# EAGLE design left (EAGLE 9.1.3)
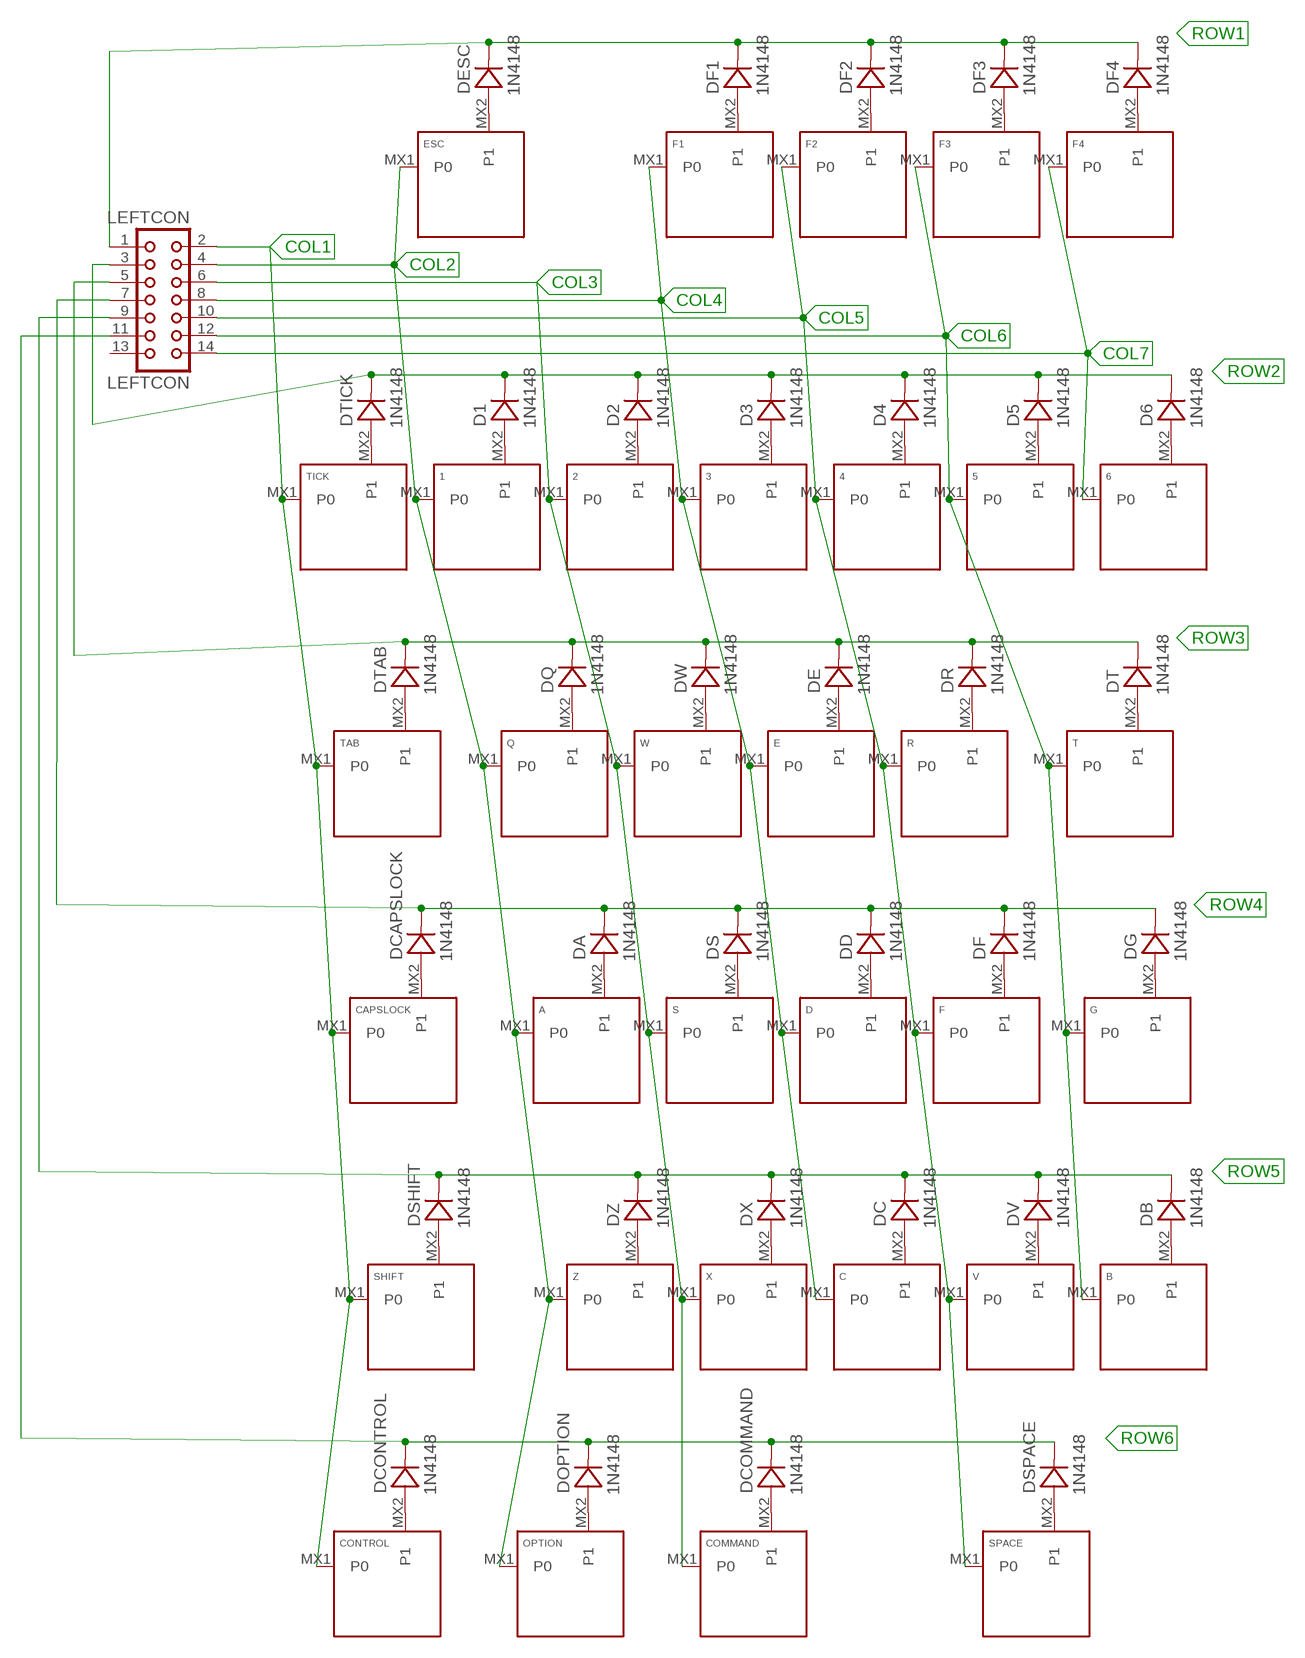
[diagram p0: schematic, sheet 1]

## Parts
1  KEYSWITCH-PLAIN-MX-1U  [MX-1U]
2  KEYSWITCH-PLAIN-MX-1U  [MX-1U]
3  KEYSWITCH-PLAIN-MX-1U  [MX-1U]
4  KEYSWITCH-PLAIN-MX-1U  [MX-1U]
5  KEYSWITCH-PLAIN-MX-1U  [MX-1U]
6  KEYSWITCH-PLAIN-MX-1U  [MX-1U]
A  KEYSWITCH-PLAIN-MX-1U  [MX-1U]
B  KEYSWITCH-PLAIN-MX-1U  [MX-1U]
C  KEYSWITCH-PLAIN-MX-1U  [MX-1U]
CAPSLOCK  KEYSWITCH-PLAIN-MX-1U  [MX-1U]
COMMAND  KEYSWITCH-PLAIN-MX-1U  [MX-1U]
CONTROL  KEYSWITCH-PLAIN-MX-1U  [MX-1U]
D  KEYSWITCH-PLAIN-MX-1U  [MX-1U]
D1  1N4148  DIODE-DO-35  [DO-35]
D2  1N4148  DIODE-DO-35  [DO-35]
D3  1N4148  DIODE-DO-35  [DO-35]
D4  1N4148  DIODE-DO-35  [DO-35]
D5  1N4148  DIODE-DO-35  [DO-35]
D6  1N4148  DIODE-DO-35  [DO-35]
DA  1N4148  DIODE-DO-35  [DO-35]
DB  1N4148  DIODE-DO-35  [DO-35]
DC  1N4148  DIODE-DO-35  [DO-35]
DCAPSLOCK  1N4148  DIODE-DO-35  [DO-35]
DCOMMAND  1N4148  DIODE-DO-35  [DO-35]
DCONTROL  1N4148  DIODE-DO-35  [DO-35]
DD  1N4148  DIODE-DO-35  [DO-35]
DE  1N4148  DIODE-DO-35  [DO-35]
DESC  1N4148  DIODE-DO-35  [DO-35]
DF  1N4148  DIODE-DO-35  [DO-35]
DF1  1N4148  DIODE-DO-35  [DO-35]
DF2  1N4148  DIODE-DO-35  [DO-35]
DF3  1N4148  DIODE-DO-35  [DO-35]
DF4  1N4148  DIODE-DO-35  [DO-35]
DG  1N4148  DIODE-DO-35  [DO-35]
DOPTION  1N4148  DIODE-DO-35  [DO-35]
DQ  1N4148  DIODE-DO-35  [DO-35]
DR  1N4148  DIODE-DO-35  [DO-35]
DS  1N4148  DIODE-DO-35  [DO-35]
DSHIFT  1N4148  DIODE-DO-35  [DO-35]
DSPACE  1N4148  DIODE-DO-35  [DO-35]
DT  1N4148  DIODE-DO-35  [DO-35]
DTAB  1N4148  DIODE-DO-35  [DO-35]
DTICK  1N4148  DIODE-DO-35  [DO-35]
DV  1N4148  DIODE-DO-35  [DO-35]
DW  1N4148  DIODE-DO-35  [DO-35]
DX  1N4148  DIODE-DO-35  [DO-35]
DZ  1N4148  DIODE-DO-35  [DO-35]
E  KEYSWITCH-PLAIN-MX-1U  [MX-1U]
ESC  KEYSWITCH-PLAIN-MX-1U  [MX-1U]
F  KEYSWITCH-PLAIN-MX-1U  [MX-1U]
F1  KEYSWITCH-PLAIN-MX-1U  [MX-1U]
F2  KEYSWITCH-PLAIN-MX-1U  [MX-1U]
F3  KEYSWITCH-PLAIN-MX-1U  [MX-1U]
F4  KEYSWITCH-PLAIN-MX-1U  [MX-1U]
G  KEYSWITCH-PLAIN-MX-1U  [MX-1U]
LEFTCON  LEFTCON  CON14  [CON14]
OPTION  KEYSWITCH-PLAIN-MX-1U  [MX-1U]
Q  KEYSWITCH-PLAIN-MX-1U  [MX-1U]
R  KEYSWITCH-PLAIN-MX-1U  [MX-1U]
S  KEYSWITCH-PLAIN-MX-1U  [MX-1U]
SHIFT  KEYSWITCH-PLAIN-MX-2U  [MX-2U]
SPACE  KEYSWITCH-PLAIN-MX-2U  [MX-2U]
T  KEYSWITCH-PLAIN-MX-1U  [MX-1U]
TAB  KEYSWITCH-PLAIN-MX-1U  [MX-1U]
TICK  KEYSWITCH-PLAIN-MX-1U  [MX-1U]
V  KEYSWITCH-PLAIN-MX-1U  [MX-1U]
W  KEYSWITCH-PLAIN-MX-1U  [MX-1U]
X  KEYSWITCH-PLAIN-MX-1U  [MX-1U]
Z  KEYSWITCH-PLAIN-MX-1U  [MX-1U]

## Nets
COL1: CAPSLOCK.MX1(P0) CONTROL.MX1(P0) LEFTCON.2 SHIFT.MX1(P0) TAB.MX1(P0) TICK.MX1(P0)
COL2: 1.MX1(P0) A.MX1(P0) ESC.MX1(P0) LEFTCON.4 OPTION.MX1(P0) Q.MX1(P0) Z.MX1(P0)
COL3: 2.MX1(P0) COMMAND.MX1(P0) LEFTCON.6 S.MX1(P0) W.MX1(P0) X.MX1(P0)
COL4: 3.MX1(P0) C.MX1(P0) D.MX1(P0) E.MX1(P0) F1.MX1(P0) LEFTCON.8
COL5: 4.MX1(P0) F2.MX1(P0) F.MX1(P0) LEFTCON.10 R.MX1(P0) SPACE.MX1(P0) V.MX1(P0)
COL6: 5.MX1(P0) B.MX1(P0) F3.MX1(P0) G.MX1(P0) LEFTCON.12 T.MX1(P0)
COL7: 6.MX1(P0) F4.MX1(P0) LEFTCON.14
N$1: DESC.A ESC.MX2(P1)
N$2: DF1.A F1.MX2(P1)
N$3: DF2.A F2.MX2(P1)
N$4: DF3.A F3.MX2(P1)
N$5: DF4.A F4.MX2(P1)
N$6: 6.MX2(P1) D6.A
N$7: 5.MX2(P1) D5.A
N$8: 4.MX2(P1) D4.A
N$9: 3.MX2(P1) D3.A
N$10: 2.MX2(P1) D2.A
N$11: 1.MX2(P1) D1.A
N$12: DTICK.A TICK.MX2(P1)
N$13: DTAB.A TAB.MX2(P1)
N$14: DQ.A Q.MX2(P1)
N$15: DW.A W.MX2(P1)
N$16: DE.A E.MX2(P1)
N$17: DR.A R.MX2(P1)
N$18: DT.A T.MX2(P1)
N$19: CAPSLOCK.MX2(P1) DCAPSLOCK.A
N$20: A.MX2(P1) DA.A
N$21: DS.A S.MX2(P1)
N$22: D.MX2(P1) DD.A
N$23: DF.A F.MX2(P1)
N$24: DG.A G.MX2(P1)
N$25: DSHIFT.A SHIFT.MX2(P1)
N$26: DZ.A Z.MX2(P1)
N$27: DX.A X.MX2(P1)
N$28: C.MX2(P1) DC.A
N$29: DV.A V.MX2(P1)
N$30: B.MX2(P1) DB.A
N$31: DSPACE.A SPACE.MX2(P1)
N$32: COMMAND.MX2(P1) DCOMMAND.A
N$33: DOPTION.A OPTION.MX2(P1)
N$34: CONTROL.MX2(P1) DCONTROL.A
ROW1: DESC.C DF1.C DF2.C DF3.C DF4.C LEFTCON.1
ROW2: D1.C D2.C D3.C D4.C D5.C D6.C DTICK.C LEFTCON.3
ROW3: DE.C DQ.C DR.C DT.C DTAB.C DW.C LEFTCON.5
ROW4: DA.C DCAPSLOCK.C DD.C DF.C DG.C DS.C LEFTCON.7
ROW5: DB.C DC.C DSHIFT.C DV.C DX.C DZ.C LEFTCON.9
ROW6: DCOMMAND.C DCONTROL.C DOPTION.C DSPACE.C LEFTCON.11
Unconnected: LEFTCON.13

## Library data of the parts
1-6 A B C CAPSLOCK COMMAND CONTROL D E ESC F F1-F4 G OPTION Q R S SHIFT SPACE T TAB TICK V W X Z = Keyboard:KEYSWITCH-PLAIN
D1-D6 DA DB DC DCAPSLOCK DCOMMAND DCONTROL DD DE DESC DF DF1-DF4 DG DOPTION DQ DR DS DSHIFT DSPACE DT DTAB DTICK DV DW DX DZ = Controller:DIODE: Standard 1N4148 diode
LEFTCON = con-harting:CON14: CONNECTOR; OC_FARNELL: unknown; OC_NEWARK: unknown

## Board
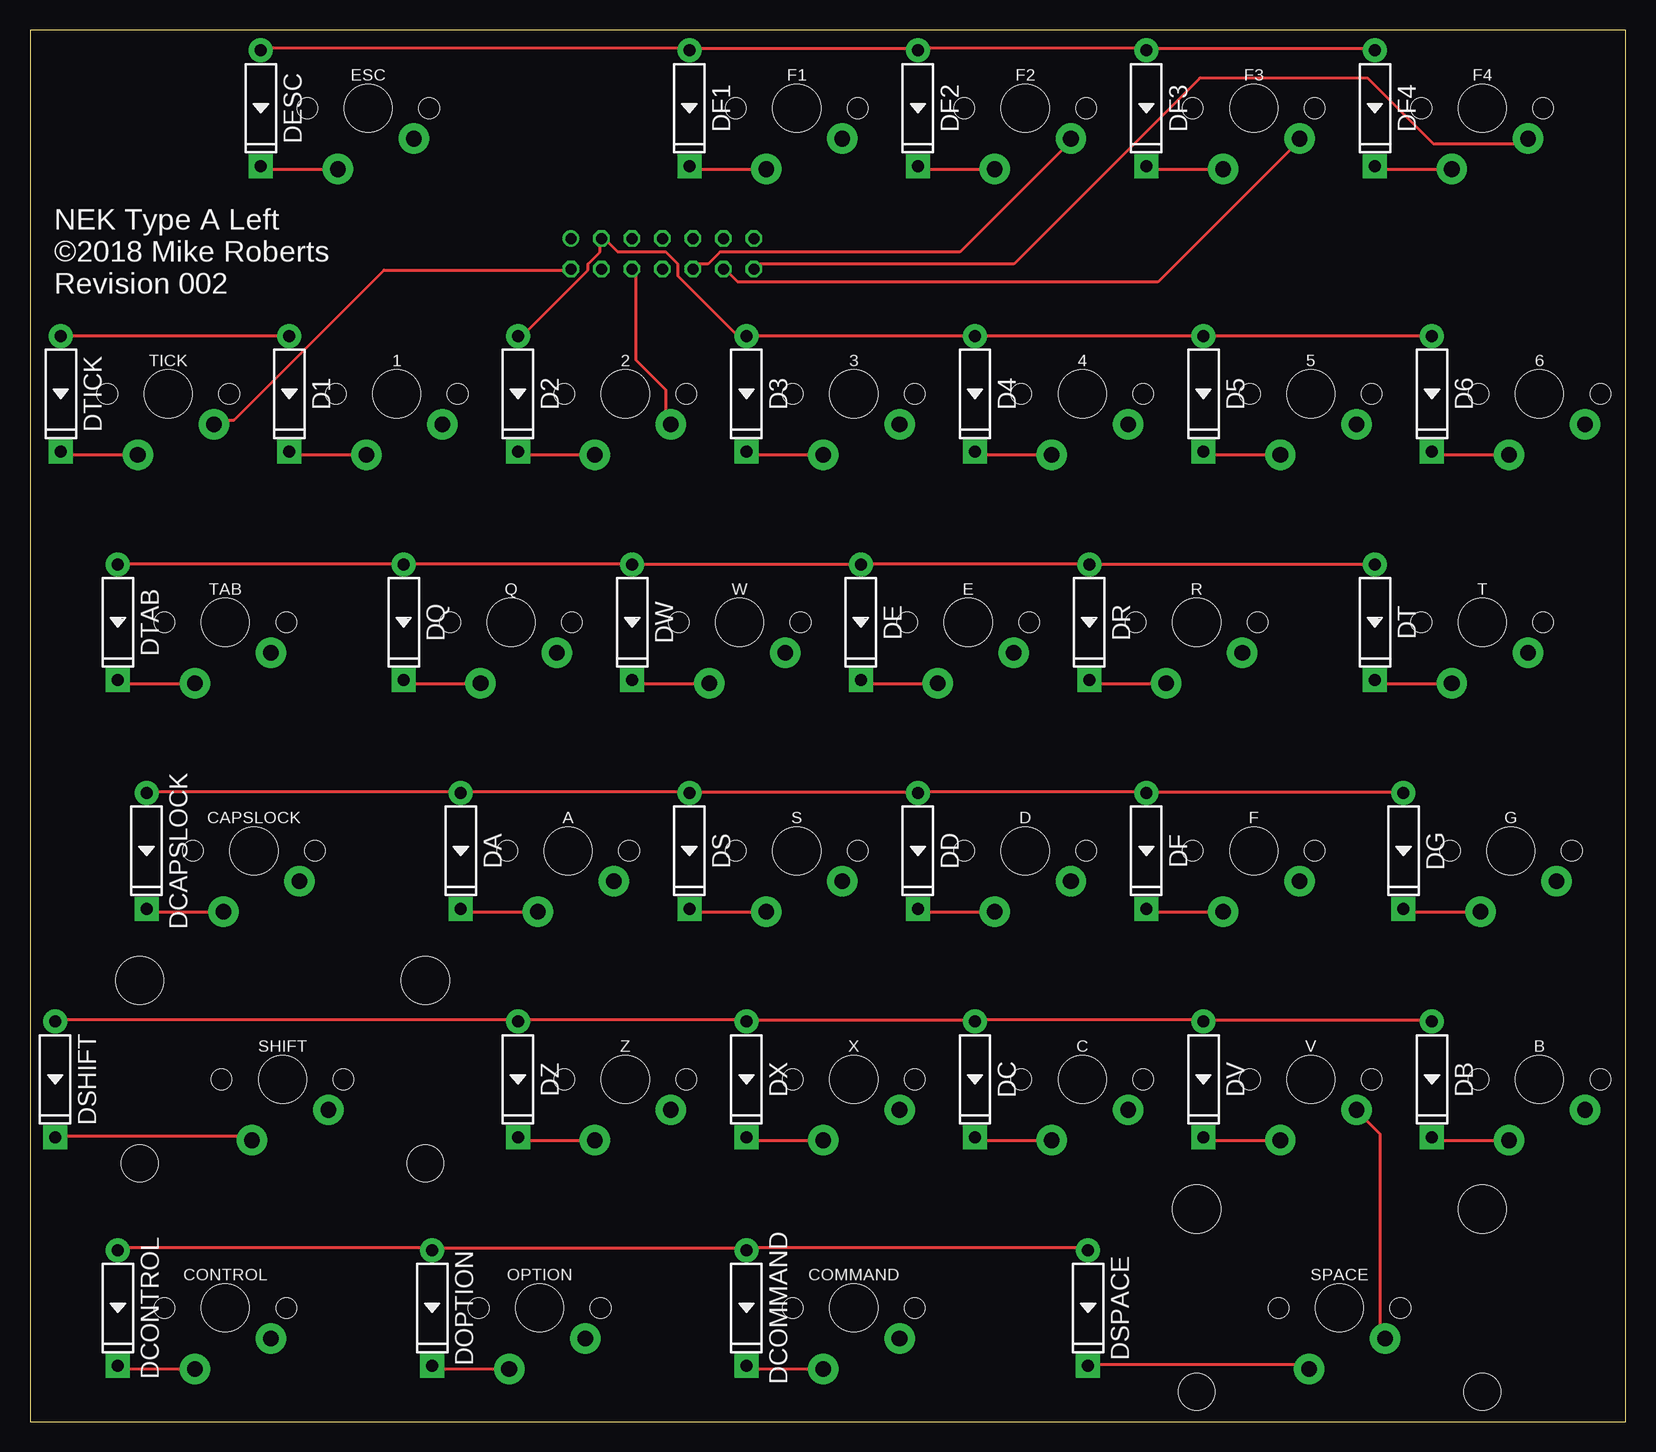
[diagram p1: board, top side]
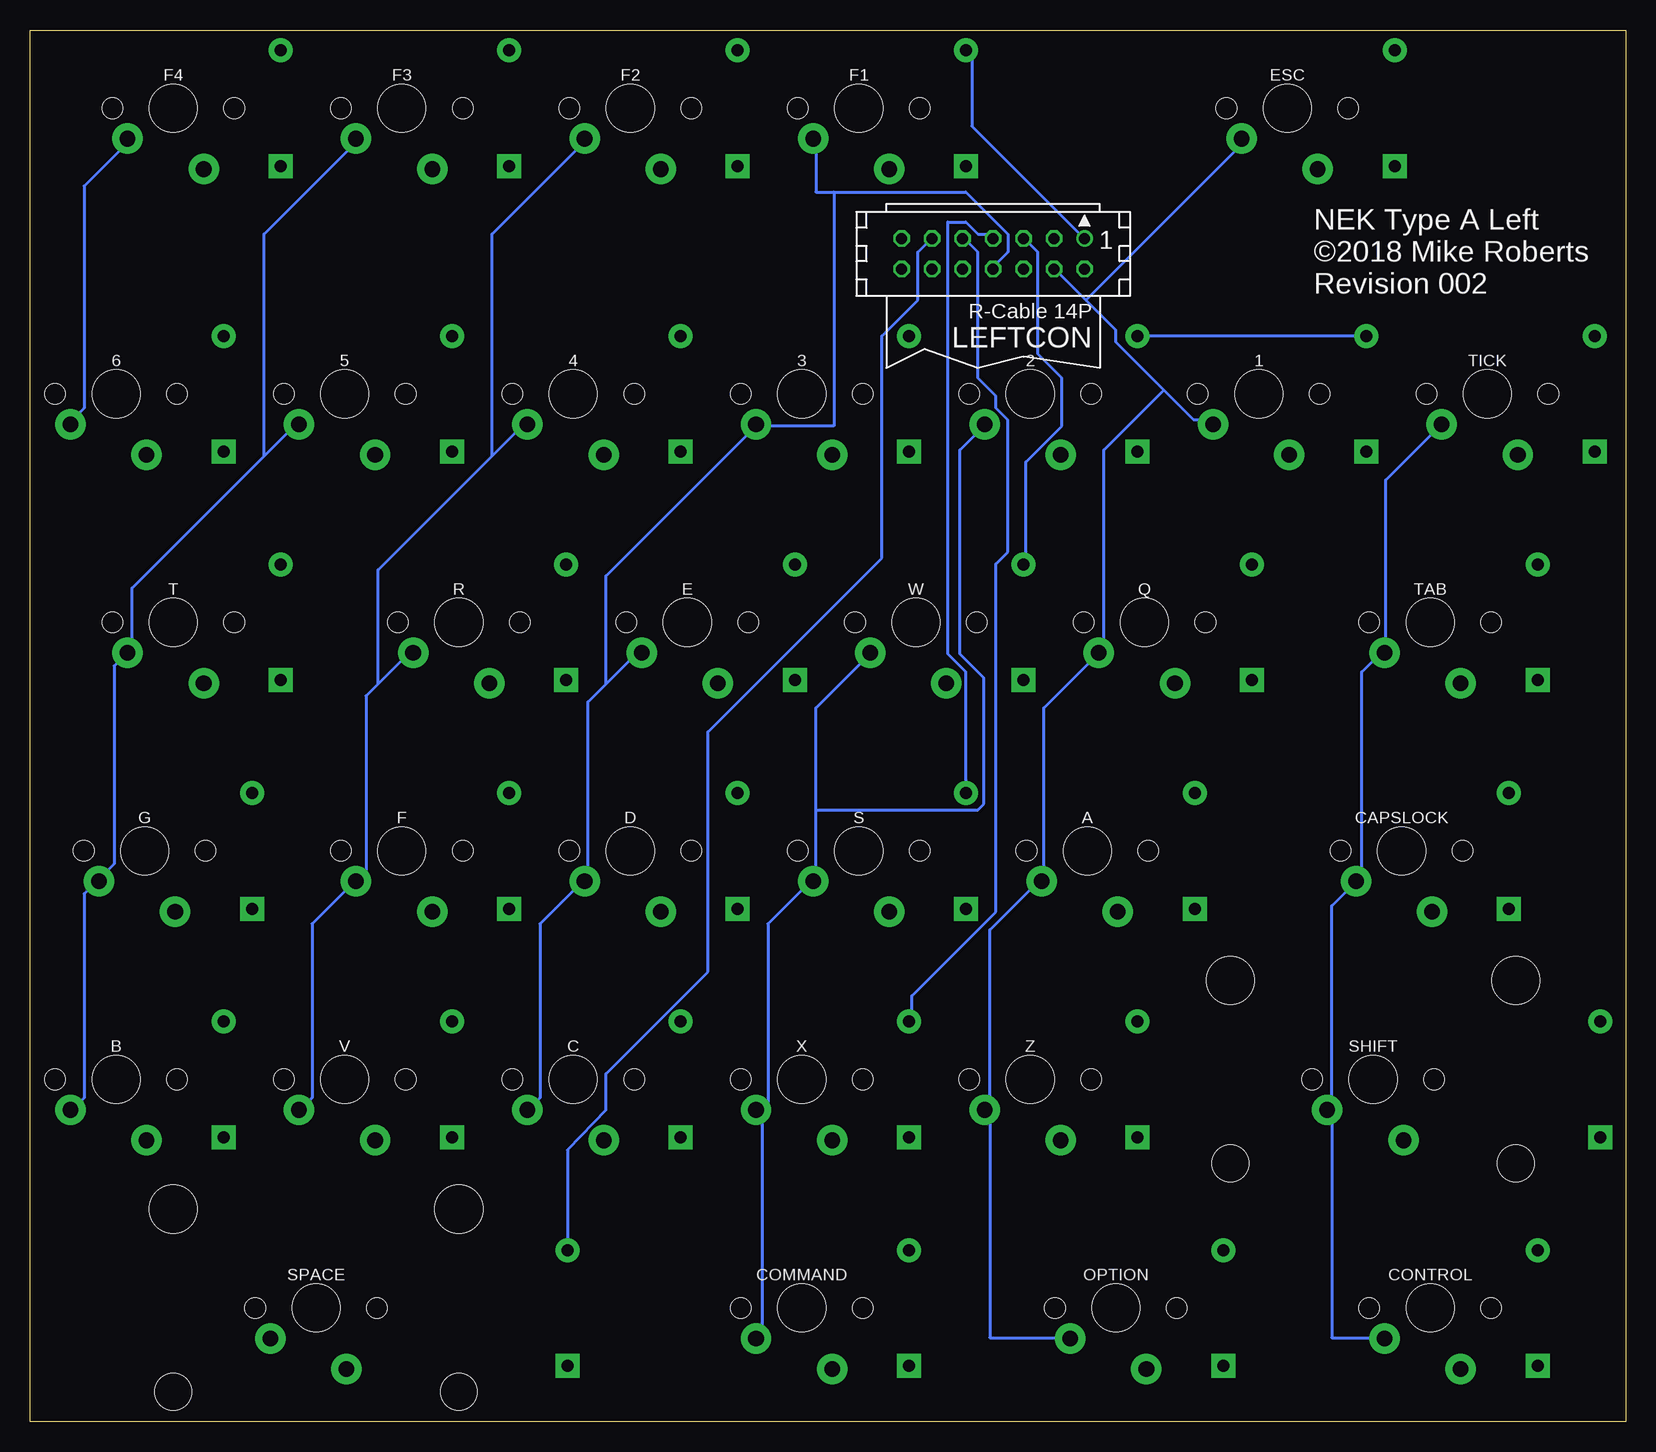
[diagram p2: board, bottom side, seen from below]

Size 133 x 116 mm. Coordinates in mm from the lower left corner, seen from the top.
Outline: 0,0 133,0 133,116 0,116 0,0
Copper layers (1*16): Top 0.035559375mm / dielectric 1.6mm / Bottom 0.035559375mm
Design rules "oshpark-2layer-auto-routing": minimum track width 10mil, minimum drill 10mil, track to track 10mil, track to pad 8mil, pad to pad 8mil, via to via 8mil, smd to smd 6mil, copper to edge 15mil, drill to drill 6mil, minimum pad ring 6mil, minimum via ring 6mil, stop-mask expansion 2.5mil, vias tented up to drill 0mil, thermal gap 10mil

### Footprints (pad centres in the part's own frame; a part is rotated, then mirrored left to right if it is on the bottom)
MX-1U = drill 1.3 pad 2.54: MX1 -3.81,2.54; MX2 2.54,5.08 | hole 4: 0,0 | hole 1.7: -5.08,0; 5.08,0
DO-35 = drill 1 pad 2 square: A 4.82,0 | drill 1 pad 2: C -4.82,0
CON14 = drill 0.914: 1 -7.62,-1.27 | drill 0.914 octagon: 2 -7.62,1.27; 3 -5.08,-1.27; 4 -5.08,1.27; 5 -2.54,-1.27; 6 -2.54,1.27; 7 0,-1.27; 8 0,1.27; 9 2.54,-1.27; 10 2.54,1.27; 11 5.08,-1.27; 12 5.08,1.27; 13 7.62,-1.27; 14 7.62,1.27
MX-2U = drill 1.3 pad 2.54: MX1 -3.81,2.54; MX2 2.54,5.08 | hole 4: 0,0; -11.9,-8.24; 11.9,-8.24 | hole 1.7: -5.08,0; 5.08,0 | hole 3.05: -11.9,7; 11.9,7

### Placement (x,y rotation side)
1  30.57,85.67 180 top
2  49.62,85.67 180 top
3  68.67,85.67 180 top
4  87.72,85.67 180 top
5  106.77,85.67 180 top
6  125.82,85.67 180 top
A  44.86,47.57 180 top
B  125.82,28.52 180 top
C  87.72,28.52 180 top
CAPSLOCK  18.66,47.57 180 top
COMMAND  68.67,9.47 180 top
CONTROL  16.28,9.47 180 top
D  82.96,47.57 180 top
D1  21.62,85.67 270 top
D2  40.67,85.67 270 top
D3  59.72,85.67 270 top
D4  78.77,85.67 270 top
D5  97.82,85.67 270 top
D6  116.87,85.67 270 top
DA  35.91,47.57 270 top
DB  116.87,28.52 270 top
DC  78.77,28.52 270 top
DCAPSLOCK  9.71,47.57 270 top
DCOMMAND  59.72,9.47 270 top
DCONTROL  7.33,9.47 270 top
DD  74.01,47.57 270 top
DE  69.25,66.62 270 top
DESC  19.24,109.48 270 top
DF  93.06,47.57 270 top
DF1  54.96,109.48 270 top
DF2  74.01,109.48 270 top
DF3  93.06,109.48 270 top
DF4  112.11,109.48 270 top
DG  114.49,47.57 270 top
DOPTION  33.53,9.47 270 top
DQ  31.15,66.62 270 top
DR  88.3,66.62 270 top
DS  54.96,47.57 270 top
DSHIFT  2.1,28.52 270 top
DSPACE  88.2,9.47 270 top
DT  112.11,66.62 270 top
DTAB  7.33,66.62 270 top
DTICK  2.57,85.67 270 top
DV  97.82,28.52 270 top
DW  50.2,66.62 270 top
DX  59.72,28.52 270 top
DZ  40.67,28.52 270 top
E  78.2,66.62 180 top
ESC  28.19,109.48 180 top
F  102.01,47.57 180 top
F1  63.91,109.48 180 top
F2  82.96,109.48 180 top
F3  102.01,109.48 180 top
F4  121.06,109.48 180 top
G  123.44,47.57 180 top
LEFTCON  52.72,97.35 180 bottom
OPTION  42.48,9.47 180 top
Q  40.1,66.62 180 top
R  97.25,66.62 180 top
S  63.91,47.57 180 top
SHIFT  21.05,28.52 180 top
SPACE  109.15,9.47 180 top
T  121.06,66.62 180 top
TAB  16.28,66.62 180 top
TICK  11.52,85.67 180 top
V  106.77,28.52 180 top
W  59.15,66.62 180 top
X  68.67,28.52 180 top
Z  49.62,28.52 180 top

### Tracks (layer width: path | path; a pad name or v marks a point on that pad's centre or on a via)
COL1
  Top 0.254: LEFTCON.2 45,96 29.5,96 17,83.5 15.5,83.5 TICK.MX1
  Bottom 0.254: CONTROL.MX1 20.5,7 24.5,7 24.5,25.5 SHIFT.MX1 24.5,26 24.5,43 22.5,45 CAPSLOCK.MX1 22,45.5 22,62.5 20.5,64 TAB.MX1 20,64.5 20,78.5 15.5,83 TICK.MX1
COL2
  Bottom 0.254: 45,93.5 42.5,91 42.5,90 38.5,86 | 45,93.5 47.5,96 LEFTCON.4 | 38.5,86 36,83.5 34.5,83.5 1.MX1 | 45,93.5 32,106.5 ESC.MX1 | OPTION.MX1 46.5,7 53,7 53,25.5 Z.MX1 53,26 53,41 49,45 A.MX1 48.5,45.5 48.5,59.5 44,64 Q.MX1 43.5,64.5 43.5,81 38.5,86
COL3
  Top 0.254: LEFTCON.6 50.5,96 50.5,88.5 53,86 53,83.5 2.MX1
  Bottom 0.254: COMMAND.MX1 72,7 72,25.5 X.MX1 72,26 71.5,26.5 71.5,41.5 68,45 S.MX1 67.5,45.5 67.5,51 | 67.5,51 67.5,59.5 63,64 W.MX1 | 67.5,51 54,51 53.5,51.5 53.5,62 55.5,64 55.5,81 53.5,83 2.MX1
COL4
  Bottom 0.254: 66,102.5 67.5,102.5 67.5,106.5 F1.MX1 | 66,102.5 55,102.5 51.5,99 51.5,97.5 52.5,96.5 LEFTCON.8 | 66,102.5 66,83 72,83 3.MX1 72.5,83 85,70.5 85,61.5 | C.MX1 91.5,26 90.5,27 90.5,41.5 87,45 D.MX1 86.5,45.5 86.5,60 85,61.5 | 85,61.5 82.5,64 E.MX1
COL5
  Top 0.254: LEFTCON.10 55.5,96.5 56.5,96.5 57.5,97.5 77.5,97.5 86.5,106.5 F2.MX1 | SPACE.MX1 112.5,7 112.5,24 111,25.5 V.MX1
  Bottom 0.254: 104,61.5 101.5,64 R.MX1 | 104,61.5 105,60.5 105,46 105.5,45.5 F.MX1 106,45 109.5,41.5 109.5,27 110.5,26 V.MX1 | 94.5,80.5 104,71 104,61.5 | 94.5,80.5 92,83 4.MX1 | 94.5,80.5 94.5,99 87,106.5 F2.MX1
COL6
  Top 0.254: LEFTCON.12 58,96 59,95 94,95 105.5,106.5 F3.MX1
  Bottom 0.254: B.MX1 129.5,26 128.5,27 128.5,44 127.5,45 G.MX1 127,45.5 126,46.5 126,63 125,64 T.MX1 124.5,64.5 124.5,69.5 113.5,80.5 | 113.5,80.5 111,83 5.MX1 | 113.5,80.5 113.5,99 106,106.5 F3.MX1
COL7
  Top 0.254: LEFTCON.14 60.5,96.5 82,96.5 97.5,112 111.5,112 117,106.5 124.5,106.5 F4.MX1
  Bottom 0.254: 6.MX1 129.5,83.5 128.5,84.5 128.5,103 125,106.5 F4.MX1
N$1
  Top 0.254: DESC.A 19.5,104.4 ESC.MX2
N$2
  Top 0.254: DF1.A 55.22,104.4 F1.MX2
N$3
  Top 0.254: DF2.A 74.27,104.4 F2.MX2
N$4
  Top 0.254: DF3.A 93.32,104.4 F3.MX2
N$5
  Top 0.254: DF4.A 112.37,104.4 F4.MX2
N$6
  Top 0.254: D6.A 117.13,80.59 6.MX2
N$7
  Top 0.254: D5.A 98.08,80.59 5.MX2
N$8
  Top 0.254: D4.A 79.03,80.59 4.MX2
N$9
  Top 0.254: D3.A 59.98,80.59 3.MX2
N$10
  Top 0.254: D2.A 40.93,80.59 2.MX2
N$11
  Top 0.254: D1.A 21.88,80.59 1.MX2
N$12
  Top 0.254: DTICK.A 2.83,80.59 TICK.MX2
N$13
  Top 0.254: DTAB.A 7.59,61.54 TAB.MX2
N$14
  Top 0.254: DQ.A 31.41,61.54 Q.MX2
N$15
  Top 0.254: DW.A 50.46,61.54 W.MX2
N$16
  Top 0.254: DE.A 69.51,61.54 E.MX2
N$17
  Top 0.254: DR.A 88.56,61.54 R.MX2
N$18
  Top 0.254: DT.A 112.37,61.54 T.MX2
N$19
  Top 0.254: DCAPSLOCK.A 9.97,42.49 CAPSLOCK.MX2
N$20
  Top 0.254: DA.A 36.17,42.49 A.MX2
N$21
  Top 0.254: DS.A 55.22,42.49 S.MX2
N$22
  Top 0.254: DD.A 74.27,42.49 D.MX2
N$23
  Top 0.254: DF.A 93.32,42.49 F.MX2
N$24
  Top 0.254: DG.A 114.75,42.49 G.MX2
N$25
  Top 0.254: DSHIFT.A 2.21,23.81 18.14,23.81 SHIFT.MX2
N$26
  Top 0.254: DZ.A 40.93,23.44 Z.MX2
N$27
  Top 0.254: DX.A 59.98,23.44 X.MX2
N$28
  Top 0.254: DC.A 79.03,23.44 C.MX2
N$29
  Top 0.254: DV.A 98.08,23.44 V.MX2
N$30
  Top 0.254: DB.A 117.13,23.44 B.MX2
N$31
  Top 0.254: DSPACE.A 88.31,4.76 106.24,4.76 SPACE.MX2
N$32
  Top 0.254: DCOMMAND.A 59.98,4.39 COMMAND.MX2
N$33
  Top 0.254: DOPTION.A 33.79,4.39 OPTION.MX2
N$34
  Top 0.254: DCONTROL.A 7.59,4.39 CONTROL.MX2
ROW1
  Top 0.254: DF4.C 112,114.5 93.5,114.5 DF3.C 93,114.5 74.5,114.5 DF2.C 74,114.5 55,114.5 DF1.C 54.5,114.5 19.5,114.5 DESC.C
  Bottom 0.254: LEFTCON.1 45.5,99 54.5,108 54.5,114 DF1.C
ROW2
  Top 0.254: D2.C 41,90.5 46.5,96 46.5,96.5 47.5,97.5 47.5,98.5 LEFTCON.3 48,98.5 49,97.5 53,97.5 54,96.5 54,95.5 59.5,90 D3.C 60,90.5 78.5,90.5 D4.C 79,90.5 97.5,90.5 D5.C 98,90.5 116.5,90.5 D6.C | DTICK.C 3,90.5 21.5,90.5 D1.C
  Bottom 0.254: D2.C 40.5,90.5 22,90.5 D1.C
ROW3
  Top 0.254: DT.C 112,71.5 88.5,71.5 DR.C 88,71.5 69.5,71.5 DE.C 69,71.5 50.5,71.5 DW.C 50,71.5 31.5,71.5 DQ.C 31,71.5 7.5,71.5 DTAB.C
  Bottom 0.254: LEFTCON.5 50,98.5 49,97.5 49,89 47,87 47,83 50,80 50,71.5 DW.C
ROW4
  Top 0.254: DG.C 114,52.5 93.5,52.5 DF.C 93,52.5 74.5,52.5 DD.C 74,52.5 55,52.5 DS.C 54.5,52.5 36,52.5 DA.C 35.5,52.5 10,52.5 DCAPSLOCK.C
  Bottom 0.254: LEFTCON.7 53,99 54,99 55,100 56.5,100 56.5,64 55,62.5 55,52.5 DS.C
ROW5
  Top 0.254: DB.C 116.5,33.5 98,33.5 DV.C 97.5,33.5 79,33.5 DC.C 78.5,33.5 60,33.5 DX.C 59.5,33.5 41,33.5 DZ.C 40.5,33.5 2.5,33.5 DSHIFT.C
  Bottom 0.254: LEFTCON.9 55,98.5 54,97.5 54,87 52.5,85.5 52.5,84.5 51.5,83.5 51.5,72.5 52.5,71.5 52.5,42.5 59.5,35.5 59.5,33.5 DX.C
ROW6
  Top 0.254: DCONTROL.C 7.5,14.5 33.5,14.5 DOPTION.C 34,14.5 59.5,14.5 DCOMMAND.C 60,14.5 88,14.5 DSPACE.C
  Bottom 0.254: LEFTCON.11 58,98.5 59,97.5 59,93.5 62,90.5 62,72 76.5,57.5 76.5,37.5 85,29 85,26 88.2,22.64 DSPACE.C

### Text on the board
tNames: NEK Type A Left / ©2018 Mike Roberts / Revision 002
bNames: NEK Type A Left / ©2018 Mike Roberts / Revision 002